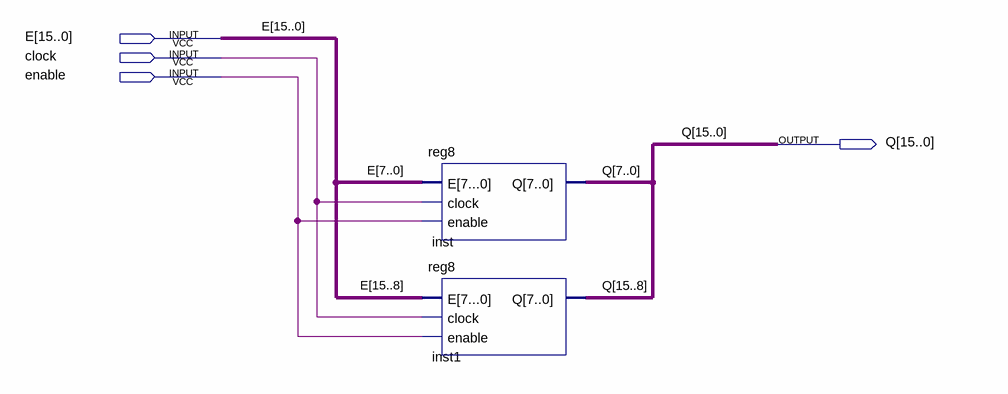
[diagram p0: schematic sheet]
// Quartus schematic reg16.bdf as structural Verilog: 2 symbols, 4 pins
module reg16 (
  input  [15:0] E,
  input  clock,
  input  enable,
  output [15:0] Q
);

  reg8 inst (.\E[7...0] (E[7:0]), .clock(clock), .enable(enable), .Q(Q[7:0]));
  reg8 inst1 (.\E[7...0] (E[15:8]), .clock(clock), .enable(enable), .Q(Q[15:8]));
endmodule
